# Altium schematic sheet e80_doppler.SchDoc
size A; SheetNumber: 1; SheetTotal: 1
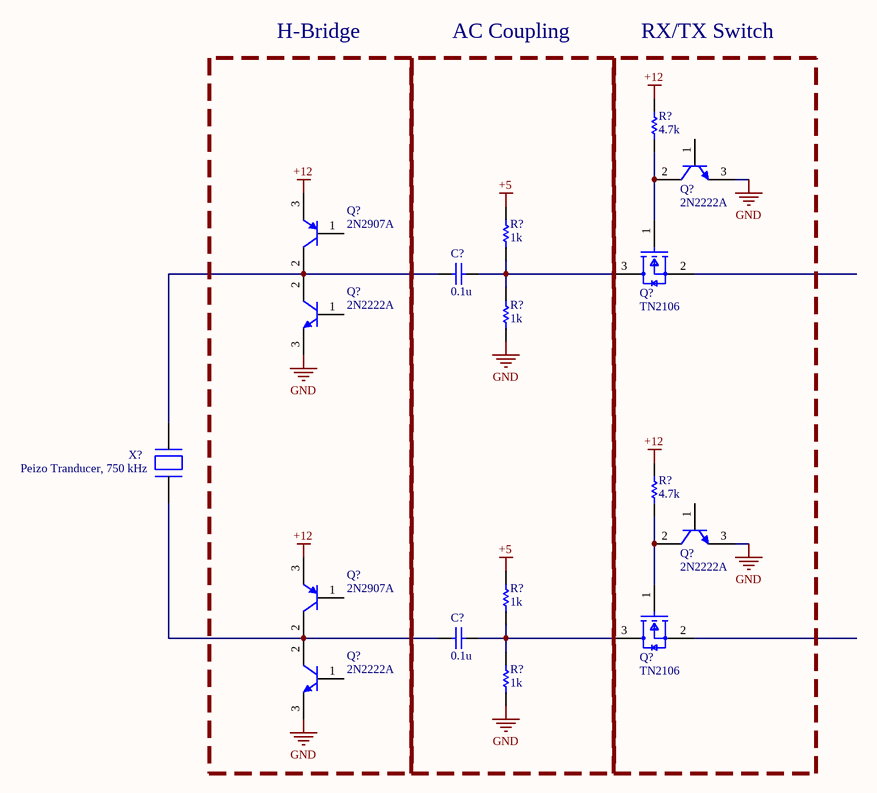
[diagram p0: e80_doppler.SchDoc]

## Parts
(Parts that share a designator on the sheet are numbered #1, #2 ... from top to bottom, then left to right.)
C?#1  value 0.1u  (hidden comment: Capacitor)
C?#2  value 0.1u  (hidden comment: Capacitor)
Q?#1  2N2222A  [STM-TO-18-3]
Q?#2  TN2106  [FP-K1-T-IPC_A]
Q?#3  2N2907A  [STM-TO-18-3]
Q?#4  2N2222A  [STM-TO-18-3]
Q?#5  2N2222A  [STM-TO-18-3]
Q?#6  TN2106  [FP-K1-T-IPC_A]
Q?#7  2N2907A  [STM-TO-18-3]
Q?#8  2N2222A  [STM-TO-18-3]
R?#1  value 4.7k  (hidden comment: Resistor)
R?#2  value 1k  (hidden comment: Resistor)
R?#3  value 1k  (hidden comment: Resistor)
R?#4  value 4.7k  (hidden comment: Resistor)
R?#5  value 1k  (hidden comment: Resistor)
R?#6  value 1k  (hidden comment: Resistor)
X?  Peizo Tranducer, 750 kHz

## Blocks framed on the sheet
H-Bridge: Q?#3 Q?#4 Q?#7 Q?#8
AC Coupling: C?#1 C?#2 R?#2 R?#3 R?#5 R?#6
RX/TX Switch: Q?#1 Q?#2 Q?#5 Q?#6 R?#1 R?#4

## Nets
+5: R?#2.2 R?#5.2
+12: Q?#3.3(E) Q?#7.3(E) R?#1.2 R?#4.2
GND: Q?#1.3(E) Q?#4.3(E) Q?#5.3(E) Q?#8.3(E) R?#3.1 R?#6.1
NetC?#1_1: C?#1.1 Q?#3.2(C) Q?#4.2(C) X?.1
NetC?#1_2: C?#1.2 Q?#2.3(Drain) R?#2.1 R?#3.2
NetC?#2_1: C?#2.1 Q?#7.2(C) Q?#8.2(C) X?.2
NetC?#2_2: C?#2.2 Q?#6.3(Drain) R?#5.1 R?#6.2
NetQ?#1_2: Q?#1.2(C) Q?#2.1(Gate) R?#1.1
NetQ?#5_2: Q?#5.2(C) Q?#6.1(Gate) R?#4.1

Not connected (* = marked no-connect by the designer): Q?#1 1(B); Q?#2 2(Source); Q?#3 1(B); Q?#4 1(B); Q?#5 1(B); Q?#6 2(Source); Q?#7 1(B); Q?#8 1(B)

## Library data of the parts
C?#1 C?#2 = Capacitor: SimulationGenericComponent: True
Q?#1 Q?#4 Q?#5 Q?#8 = CMP-2000-05381-1: High Speed Switch, 0.6 A IC, -65 to 175 degC, 3-Pin TO-18, RoHS, Bulk; Manufacturer: STMicroelectronics; Power Dissipation Pd: 500mW; DC Current Gain hFE: 300hFE; Transistor Polarity: NPN; DC Collector Current: 600mA; No. of Pins: 3Pins; Transition Frequency ft: 300MHz; Collector Emitter Voltage V(br)ceo: 40V; Product Range: -; Package Reference: TO-18-3; Datasheet URL: https://datasheet.ciiva.com/25917/cd00003223-25917094.pdf; Automotive Qualification Standard: -; Transistor Case Style: TO-18; Operating Temperature Max: 175degC; Datasheet Version: Feb-03; Package Description: 3-Pin Through Hole Device, Dia 5.8 mm, Pitch 1.27 mm; Manufacturer URL: http://www.st.com/
Q?#2 Q?#6 = CMP-06369-000018-1: MOSFET N-CH 60V 280MA SOT23-3; Input Capacitance: 50pF; Turn-On Delay Time: 3ns; Number of Elements: 1; Power Dissipation: 360mW; Drain to Source Resistance: 2.5R; Fall Time: 5ns; Turn-Off Delay Time: 6ns; Gate to Source Voltage (Vgs): 20V; Polarity: N-CHANNEL; Element Configuration: Single; Min Operating Temperature: -55°C; Height: 0.95mm; Width: 1.3mm; Radiation Hardening: No; Mount: Surface Mount; Weight: 0.050717oz; Rds On Max: 2.5R; Packaging: Tape and Reel; Contact Plating: Tin; Package Quantity: 3000; Max Power Dissipation: 360mW; Number of Channels: 1; Drain to Source Breakdown Voltage: 60V; Max Operating Temperature: 150°C; Rise Time: 5ns; Case/Package: SOT-23; Continuous Drain Current (ID): 280mA; Number of Pins: 3; Series: -; Length: 2.9mm
Q?#3 Q?#7 = CMP-2000-05561-1: Small Signal PNP Transistor, 0.4 W, 60 V, 600 mA, 3-Pin TO-18, RoHS, Bulk; Manufacturer: STMicroelectronics; Transition Frequency ft: 200MHz; Collector Emitter Voltage V(br)ceo: -60V; Power Dissipation Pd: 400mW; No. of Pins: 3Pins; SVHC: NoSVHC(17-Dec-2015); DC Collector Current: -600mA; DC Current Gain hFE: 300hFE; MSL: -; Operating Temperature Max: 175°C; Product Range: -; Datasheet Version: 02/2003; Automotive Qualification Standard: -; Transistor Case Style: TO-18; Manufacturer URL: http://www.st.com/; Mounting Technology: ThroughHole; Package Description: 3-Pin Through Hole Device, Dia 5.8 mm, Pitch 1.27 mm; Package Reference: TO-18-3; Datasheet URL: https://datasheet.ciiva.com/16614/cd00003088-16614659.pdf; Transistor Polarity: PNP
R?#1-R?#6 = Resistor: TC1: 0; SimulationGenericComponent: True; TC2: 0
X? = SMD20T27F750S